# EAGLE design TinyG3DPrinterController (EAGLE 6.6.0)

## Sheet 1 of 2
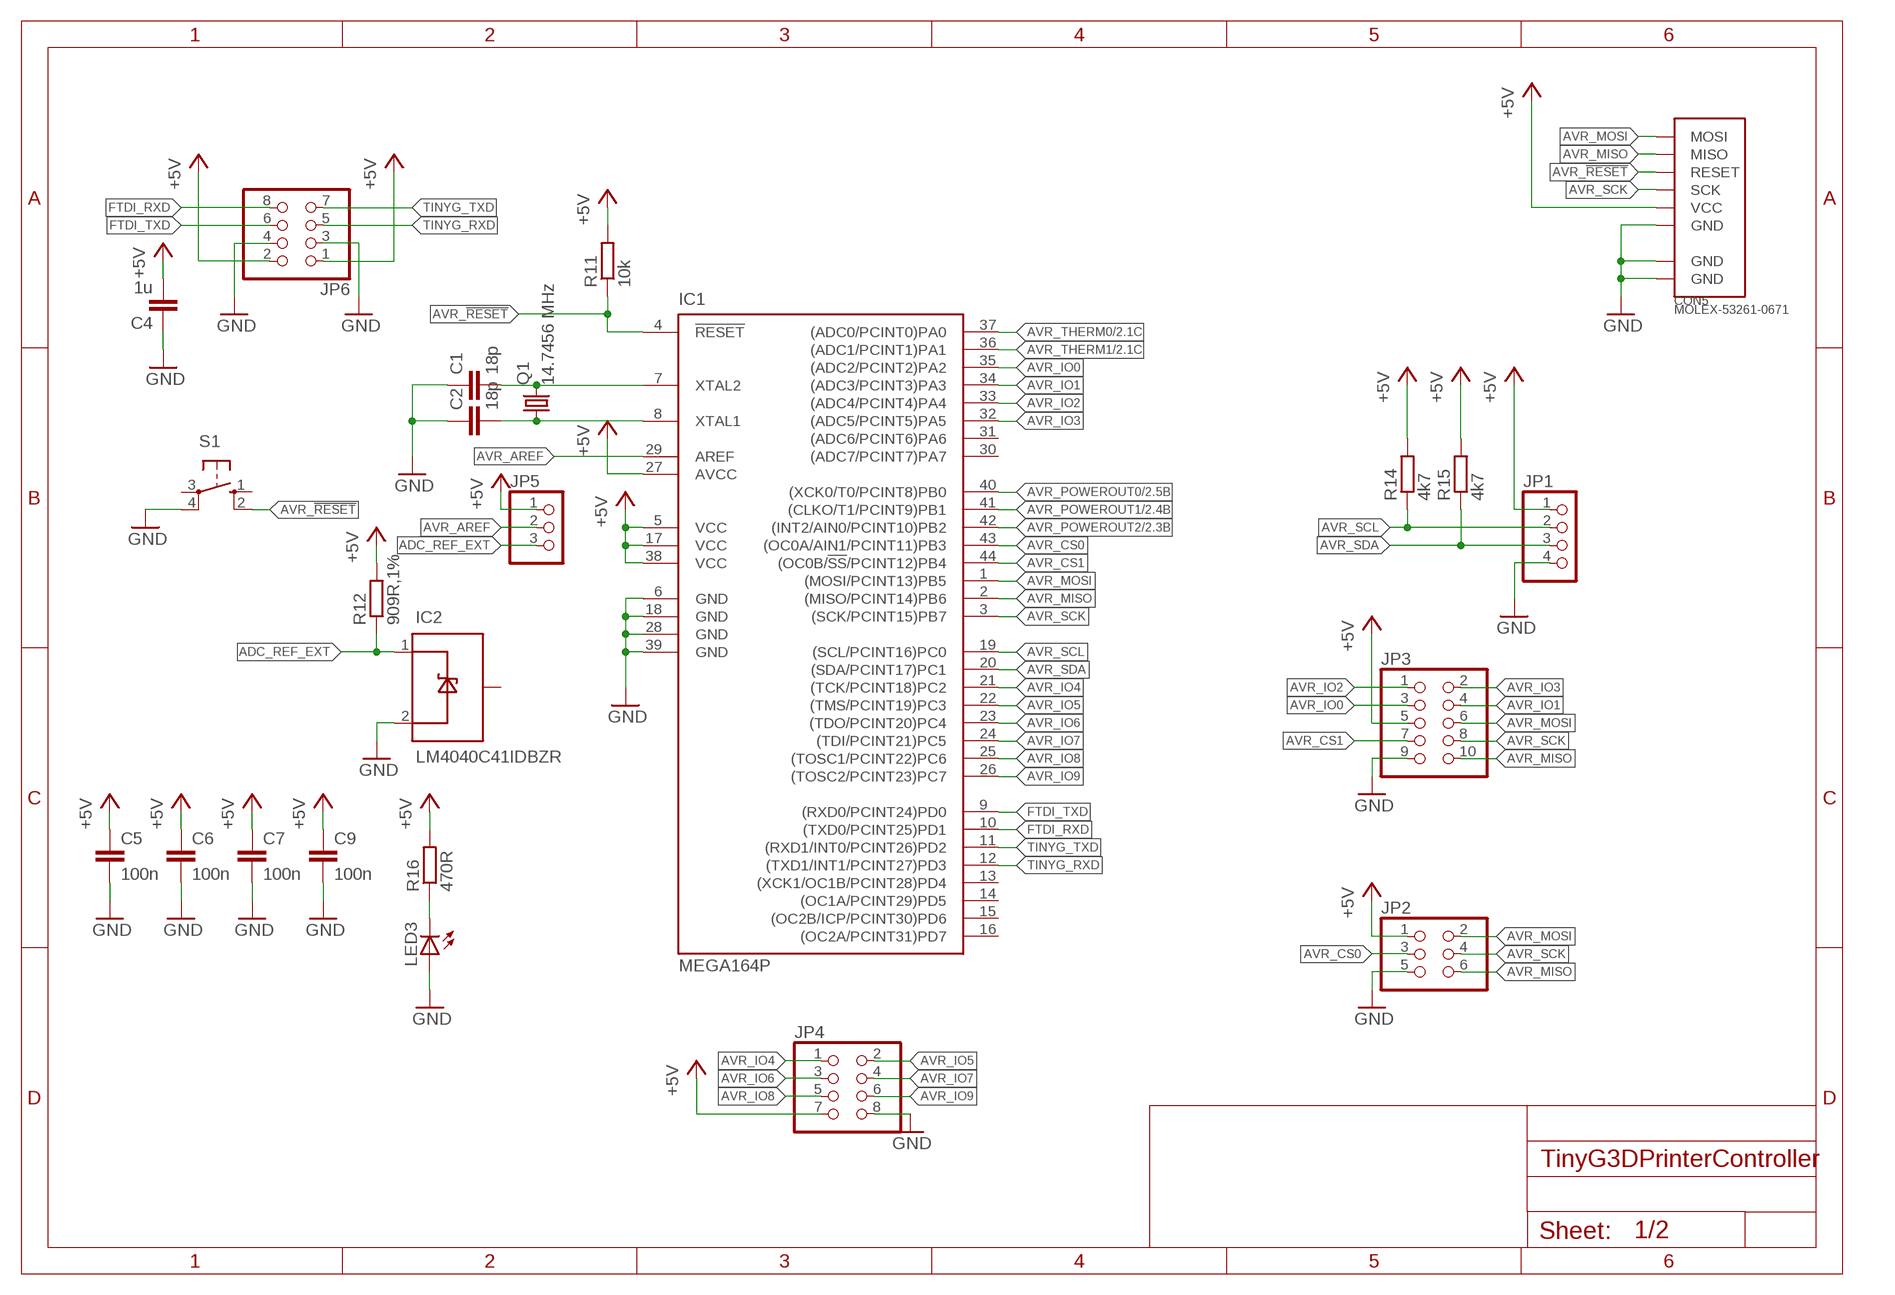
[diagram p0: schematic, sheet 1]

### Parts
C1  18p  C-EUC0603K  [C0603K]
C2  18p  C-EUC0603K  [C0603K]
C4  1u  C-EUC1206K  [C1206K]
C5  100n  C-EUC0603K  [C0603K]
C6  100n  C-EUC0603K  [C0603K]
C7  100n  C-EUC0603K  [C0603K]
C9  100n  C-EUC0603K  [C0603K]
CON5  MOLEX-53261-0671  [MOLEX-53261-0671]
IC1  MEGA164P  MEGA164P/324P/644P-AU  [TQFP44]
IC2  LM4040C41IDBZR  [SOT-23-3]
JP1  PINHD-1X4  [1X04]
JP2  PINHD-2X3  [2X03]
JP3  PINHD-2X5  [2X05]
JP4  PINHD-2X4  [2X04]
JP5  PINHD-1X3  [1X03]
JP6  PINHD-2X4  [2X04]
LED3  LEDCHIP-LED0805  [CHIP-LED0805]
Q1  14.7456 MHz  7A-14.7456MAAJ-T-SMD_CRYSTAL  [CRYSTAL_2P_5MMX3.2MM]
R11  10k  R-EU_R0603  [R0603]
R12  909R,1%  R-EU_R0603  [R0603]
R14  4k7  R-EU_R0603  [R0603]
R15  4k7  R-EU_R0603  [R0603]
R16  470R  R-EU_R0603  [R0603]
S1  10-XX  [B3F-10XX]

### Nets
+5V: C4.2 C5.1 C6.1 C7.1 C9.1 CON5.5(VCC) IC1.5(VCC) IC1.17(VCC) IC1.27(AVCC) IC1.38(VCC) JP1.1 JP2.1 JP3.5 JP4.7 JP5.1 JP6.1 JP6.2 R11.2 R12.2 R14.2 R15.2 R16.2 ; also sheet 2
ADC_REF_EXT: IC2.1 JP5.3 R12.1
AVR_!RESET: CON5.3(RESET) IC1.4(!RESET) R11.1 S1.2(S1)
AVR_AREF: IC1.29(AREF) JP5.2
AVR_CS0: IC1.43((OC0A/AIN1/PCINT11)PB3) JP2.3
AVR_CS1: IC1.44((OC0B/!SS!/PCINT12)PB4) JP3.7
AVR_IO0: IC1.35((ADC2/PCINT2)PA2) JP3.3
AVR_IO1: IC1.34((ADC3/PCINT3)PA3) JP3.4
AVR_IO2: IC1.33((ADC4/PCINT4)PA4) JP3.1
AVR_IO3: IC1.32((ADC5/PCINT5)PA5) JP3.2
AVR_IO4: IC1.21((TCK/PCINT18)PC2) JP4.1
AVR_IO5: IC1.22((TMS/PCINT19)PC3) JP4.2
AVR_IO6: IC1.23((TDO/PCINT20)PC4) JP4.3
AVR_IO7: IC1.24((TDI/PCINT21)PC5) JP4.4
AVR_IO8: IC1.25((TOSC1/PCINT22)PC6) JP4.5
AVR_IO9: IC1.26((TOSC2/PCINT23)PC7) JP4.6
AVR_MISO: CON5.2(MISO) IC1.2((MISO/PCINT14)PB6) JP2.6 JP3.10
AVR_MOSI: CON5.1(MOSI) IC1.1((MOSI/PCINT13)PB5) JP2.2 JP3.6
AVR_POWEROUT0: IC1.40((XCK0/T0/PCINT8)PB0) ; also sheet 2
AVR_POWEROUT1: IC1.41((CLKO/T1/PCINT9)PB1) ; also sheet 2
AVR_POWEROUT2: IC1.42((INT2/AIN0/PCINT10)PB2) ; also sheet 2
AVR_SCK: CON5.4(SCK) IC1.3((SCK/PCINT15)PB7) JP2.4 JP3.8
AVR_SCL: IC1.19((SCL/PCINT16)PC0) JP1.2 R14.1
AVR_SDA: IC1.20((SDA/PCINT17)PC1) JP1.3 R15.1
AVR_THERM0: IC1.37((ADC0/PCINT0)PA0) ; also sheet 2
AVR_THERM1: IC1.36((ADC1/PCINT1)PA1) ; also sheet 2
FTDI_RXD: IC1.10((TXD0/PCINT25)PD1) JP6.8
FTDI_TXD: IC1.9((RXD0/PCINT24)PD0) JP6.6
GND: C1.1 C2.1 C4.1 C5.2 C6.2 C7.2 C9.2 CON5.6(GND) CON5.GND@1(GND) CON5.GND@2(GND) IC1.6(GND) IC1.18(GND) IC1.28(GND) IC1.39(GND) IC2.2 JP1.4 JP2.5 JP3.9 JP4.8 JP6.3 JP6.4 LED3.A S1.4(P1) ; also sheet 2
N$1: C1.2 IC1.7(XTAL2) Q1.P$2
N$2: C2.2 IC1.8(XTAL1) Q1.P$1
N$12: LED3.C R16.1
TINYG_RXD: IC1.12((TXD1/INT1/PCINT27)PD3) JP6.5
TINYG_TXD: IC1.11((RXD1/INT0/PCINT26)PD2) JP6.7
Unconnected: IC1.13((XCK1/OC1B/PCINT28)PD4) IC1.14((OC1A/PCINT29)PD5) IC1.15((OC2B/ICP/PCINT30)PD6) IC1.16((OC2A/PCINT31)PD7) IC1.30((ADC7/PCINT7)PA7) IC1.31((ADC6/PCINT6)PA6) IC2.3 S1.1(S) S1.3(P)

## Sheet 2 of 2
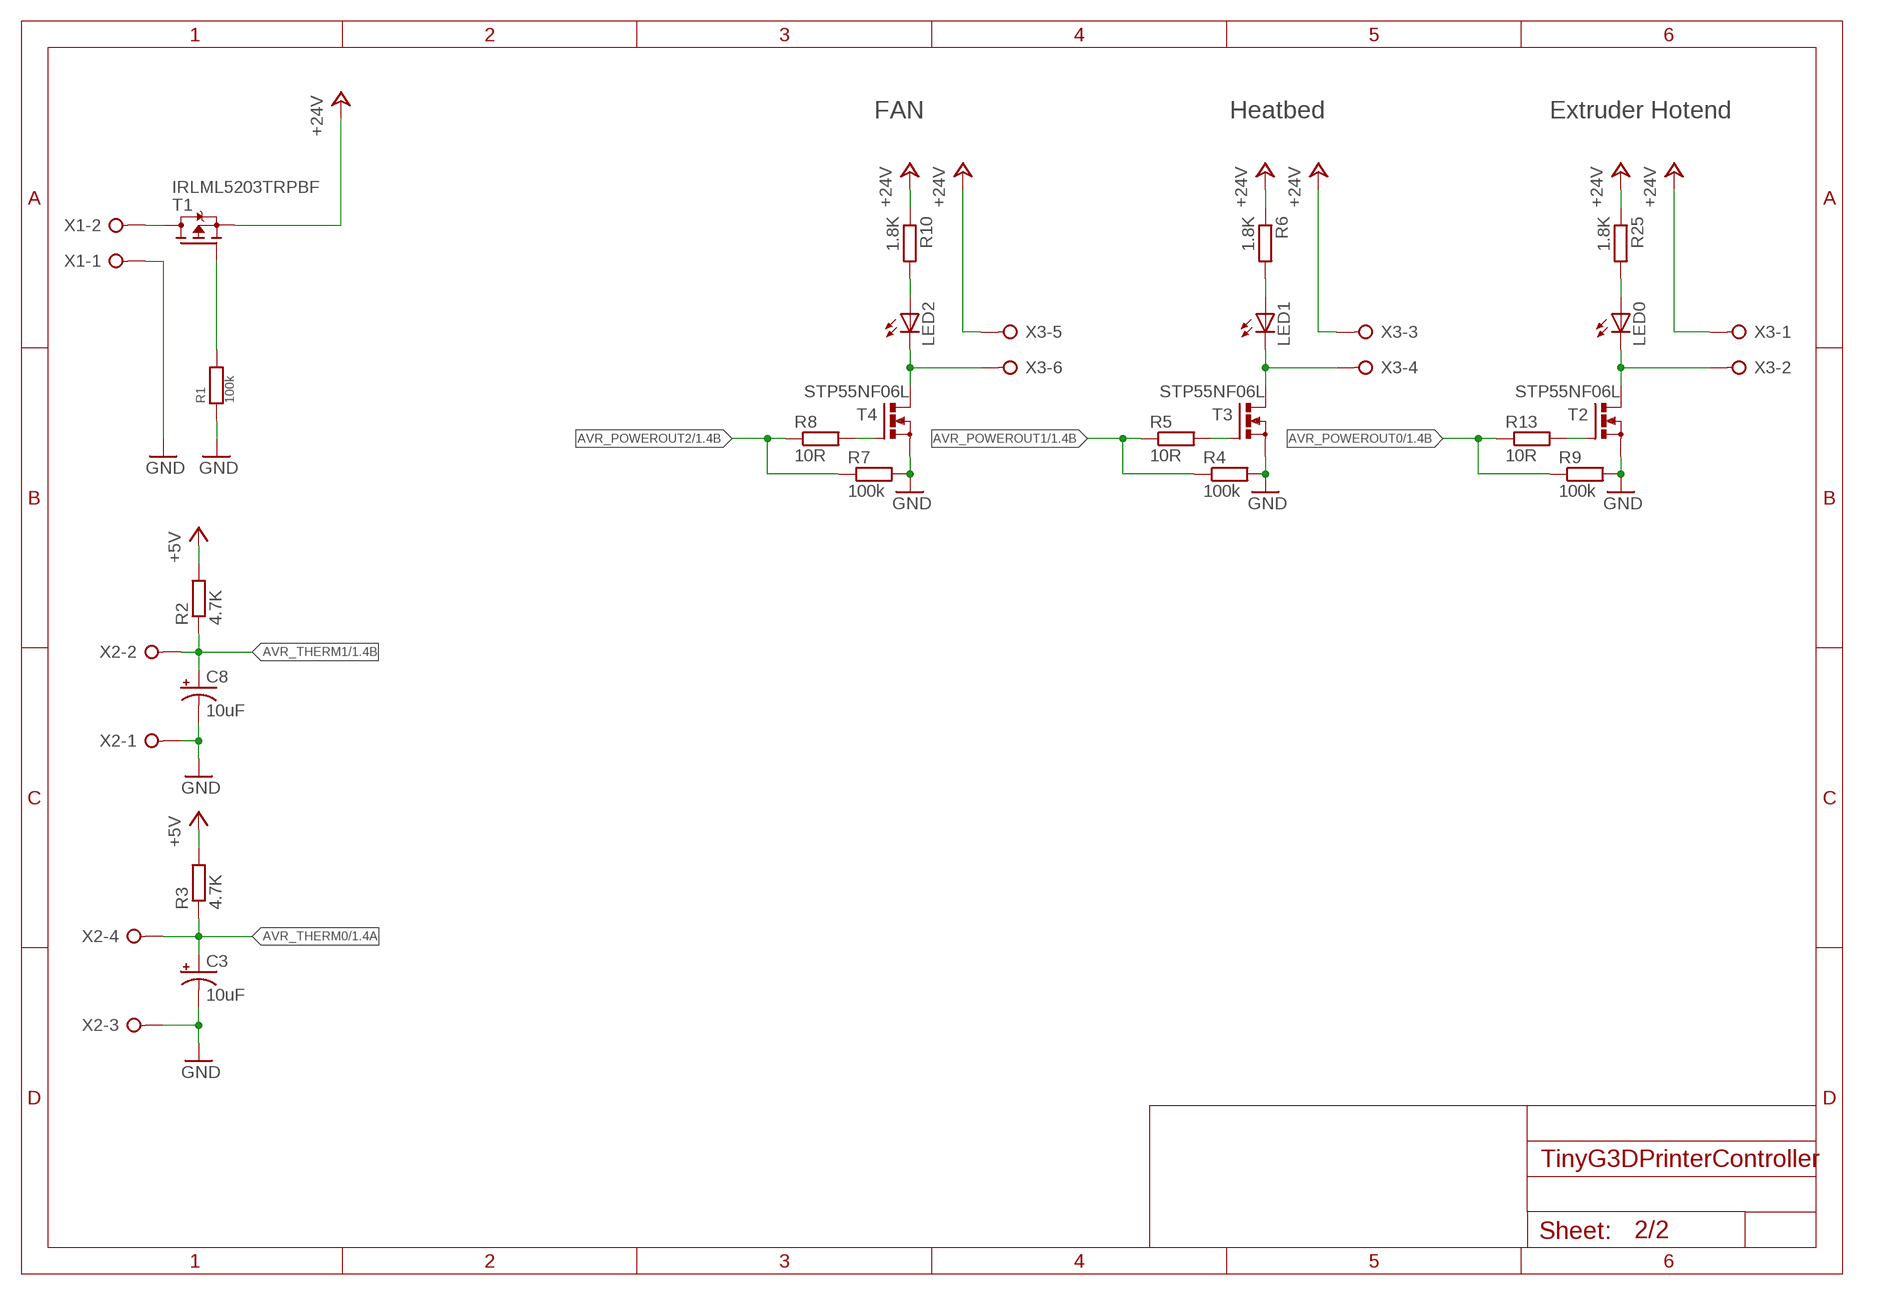
[diagram p1: schematic, sheet 2]

### Parts
C3  10uF  CPOL-US153CLV-0405  [153CLV-0405]
C8  10uF  CPOL-US153CLV-0405  [153CLV-0405]
LED0  LEDCHIP-LED0805  [CHIP-LED0805]
LED1  LEDCHIP-LED0805  [CHIP-LED0805]
LED2  LEDCHIP-LED0805  [CHIP-LED0805]
R1  100k  R0603  [R0603]
R2  4.7K  R-EU_R0603  [R0603]
R3  4.7K  R-EU_R0603  [R0603]
R4  100k  R-EU_R0603  [R0603]
R5  10R  R-EU_R0603  [R0603]
R6  1.8K  R-EU_R0603  [R0603]
R7  100k  R-EU_R0603  [R0603]
R8  10R  R-EU_R0603  [R0603]
R9  100k  R-EU_R0603  [R0603]
R10  1.8K  R-EU_R0603  [R0603]
R13  10R  R-EU_R0603  [R0603]
R25  1.8K  R-EU_R0603  [R0603]
T1  IRLML5203TRPBF  [SOT23]
T2  STP55NF06L  IRF512  [TO220BV]
T3  STP55NF06L  IRF512  [TO220BV]
T4  STP55NF06L  IRF512  [TO220BV]
X1  W237-02P  [W237-132]
X2  W237-04P  [W237-4P]
X3  W237-06P  [W237-6P]

### Nets
+5V: R2.2 R3.2 ; also sheet 1
+24V: R6.1 R10.1 R25.1 T1.2(S) X3.1 X3.3 X3.5
AVR_POWEROUT0: R9.1 R13.1 ; also sheet 1
AVR_POWEROUT1: R4.1 R5.1 ; also sheet 1
AVR_POWEROUT2: R7.1 R8.1 ; also sheet 1
AVR_THERM0: C3.+ R3.1 X2.4 ; also sheet 1
AVR_THERM1: C8.+ R2.1 X2.2 ; also sheet 1
GND: C3.- C8.- R1.1 R4.2 R7.2 R9.2 T2.S T3.S T4.S X1.1 X2.1 X2.3 ; also sheet 1
N$3: R1.2 T1.1(G)
N$4: T1.3(D) X1.2
N$5: LED0.C T2.D X3.2
N$6: R5.2 T3.G
N$7: LED1.A R6.2
N$8: LED1.C T3.D X3.4
N$9: R8.2 T4.G
N$10: LED2.A R10.2
N$11: LED2.C T4.D X3.6
N$48: R13.2 T2.G
N$50: LED0.A R25.2

### Notes on the sheet
- FAN | Heatbed | Extruder Hotend

## Library data of the parts
C1 C2 C4-C7 C9 = rcl:C-EU: CAPACITOR, European symbol
C3 C8 = adafruit:CPOL-US: POLARIZED CAPACITOR, American symbol
CON5 = SchlegelAr_Master:MOLEX-53261-0671: MOLEX-53261-0671 - Molex picoblade 53261-0671 6 pol last modified: Armin Schlegel, 28.04.2014 http://de.mouser.com/ProductDetail/Molex/53261-0671/?qs=%2Fha2pyFadujL8XqTNrjzA%2Fy0AZso5hx2IWE7X8dEAdsn1tpb%2FKahAA%3D%3D http://www.mouser.com/ds/2/276/0532610671_PCB_HEADERS-170915.pdf
IC1 = avr-7:MEGA164P/324P/644P-AU
IC2 = SchlegelArmin:LM4040C41IDBZR: LM4040C41IDBZR Spannungsreferenzen 4.096-V Precision Mcrpwr Shunt .5% acc Mouser Link <http://www.mouser.de/ProductDetail/Texas-Instruments/LM4040C41IDBZR/?qs=sGAEpiMZZMuBck1X%252b7j9fBabmn44eJPpud3DQU8p4AU%3d> Datenblatt <http://www.mouser.com/ds/2/405/lm4040c41-556715.pdf>
JP1 = pinhead:PINHD-1X4: PIN HEADER
JP2 = pinhead:PINHD-2X3: PIN HEADER
JP3 = pinhead:PINHD-2X5: PIN HEADER
JP4 JP6 = pinhead:PINHD-2X4: PIN HEADER
JP5 = pinhead:PINHD-1X3: PIN HEADER
LED0 LED1-LED3 = led:LED: LED OSRAM: - CHIPLED LG R971, LG N971, LY N971, LG Q971, LY Q971, LO R971, LY R971 LH N974, LH R974 LS Q976, LO Q976, LY Q976 LO Q996 - Hyper CHIPLED LW Q18S LB Q993, LB Q99A, LB R99A - SideLED LS A670, LO A670, LY A670, LG A670, LP A670 LB A673, LV A673, LT A673, LW A673 LH A674 LY A675 LS A676, LA A676, LO A676, LY A676, LW A676 LS A679, LY A679, LG A679 - Hyper Micro SIDELED® LS Y876, LA Y876, LO Y876, LY Y876 LT Y87S - SmartLED LW L88C, LW L88S LB L89C, LB L89S, LG L890 LS L89K, LO L89K, LY L89K LS L896, LA L896, LO L896, LY L896 - TOPLED LS T670, LO T670, LY T670, LG T670, LP T670 LSG T670, LSP T670, LSY T670, LOP T670, LYG T670 LG T671, LOG T671, LSG T671 LB T673, LV T673, LT T673, LW T673 LH T674 LS T676, LA T676, LO T676, LY T676, LB T676, LH T676, LSB T676, LW T676 LB T67C, LV T67C, LT T67C, LS T67K, LO T67K, LY T67K, LW E67C LS E67B, LA E67B, LO E67B, LY E67B, LB E67C, LV E67C, LT E67C LW T67C LS T679, LY T679, LG T679 LS T770, LO T770, LY T770, LG T770, LP T770 LB T773, LV T773, LT T773, LW T773 LH T774 LS E675, LA E675, LY E675, LS T675 LS T776, LA T776, LO T776, LY T776, LB T776 LHGB T686 LT T68C, LB T68C - Hyper Mini TOPLED® LB M676 - Mini TOPLED Santana® LG M470 LS M47K, LO M47K, LY M47K Source: http://www.osram.convergy.de LUXEON: - LUMILED® LXK2-PW12-R00, LXK2-PW12-S00, LXK2-PW14-U00, LXK2-PW14-V00 LXK2-PM12-R00, LXK2-PM12-S00, LXK2-PM14-U00 LXK2-PE12-Q00, LXK2-PE12-R00, LXK2-PE12-S00, LXK2-PE14-T00, LXK2-PE14-U00 LXK2-PB12-K00, LXK2-PB12-L00, LXK2-PB12-M00, LXK2-PB14-N00, LXK2-PB14-P00, LXK2-PB14-Q00 LXK2-PR12-L00, LXK2-PR12-M00, LXK2-PR14-Q00, LXK2-PR14-R00 LXK2-PD12-Q00, LXK2-PD12-R00, LXK2-PD12-S00 LXK2-PH12-R00, LXK2-PH12-S00 LXK2-PL12-P00, LXK2-PL12-Q00, LXK2-PL12-R00 Source: www.luxeon.com KINGBRIGHT: KA-3528ASYC Source: www.kingbright.com
Q1 = SchlegelArmin:7A-14.7456MAAJ-T-SMD_CRYSTAL: 7A-14.7456MAAJ-T - SMD Crystal 14.7456 MHz - 5mm x 3.2mm Mouser Link <http://www.mouser.de/ProductDetail/TXC-Corporation/7A-147456MAAJ-T/?qs=sGAEpiMZZMsBj6bBr9Q9adCqSFogF%2fCnC4CKHvO9H9A%3d> Datenblatt <http://www.mouser.com/ds/2/417/7a-13881.pdf>
R1 = SchlegelAr_Master:R: Widerstaende in 0402, 0603, 0805, 1206, 2512 last modified: Armin Schlegel, 28.04.2014
R2-R16 R25 = rcl:R-EU_: RESISTOR, European symbol
S1 = switch-omron:10-XX: OMRON SWITCH; MPN: B3F-1000; OC_FARNELL: 176432; OC_NEWARK: 36M3542
T1 = SchlegelAr_Master:IRLML5203TRPBF: IRLML5203TRPBF - MOSFET MOSFT P-Ch -30V -3A 98mOhm 9.5nC Log Lvl last modified: Armin Schlegel, 28.04.2014 http://de.mouser.com/ProductDetail/International-Rectifier/IRLML5203TRPBF/?qs=sGAEpiMZZMshyDBzk1%2fWi5%252bqVgN3%252bWS8t7qb9msI9Rk%3d http://www.mouser.com/ds/2/200/irlml5203pbf-223113.pdf
T2-T4 = transistor-power:IRF512: N-CHANNEL MOS FET
X1 = con-wago-508:W237-02P: WAGO SREW CLAMP; OC_FARNELL: unknown; OC_NEWARK: unknown
X2 = con-wago-508:W237-04P: WAGO SREW CLAMP; OC_FARNELL: unknown; OC_NEWARK: unknown
X3 = con-wago-508:W237-06P: WAGO SREW CLAMP; OC_FARNELL: unknown; OC_NEWARK: unknown

## Board
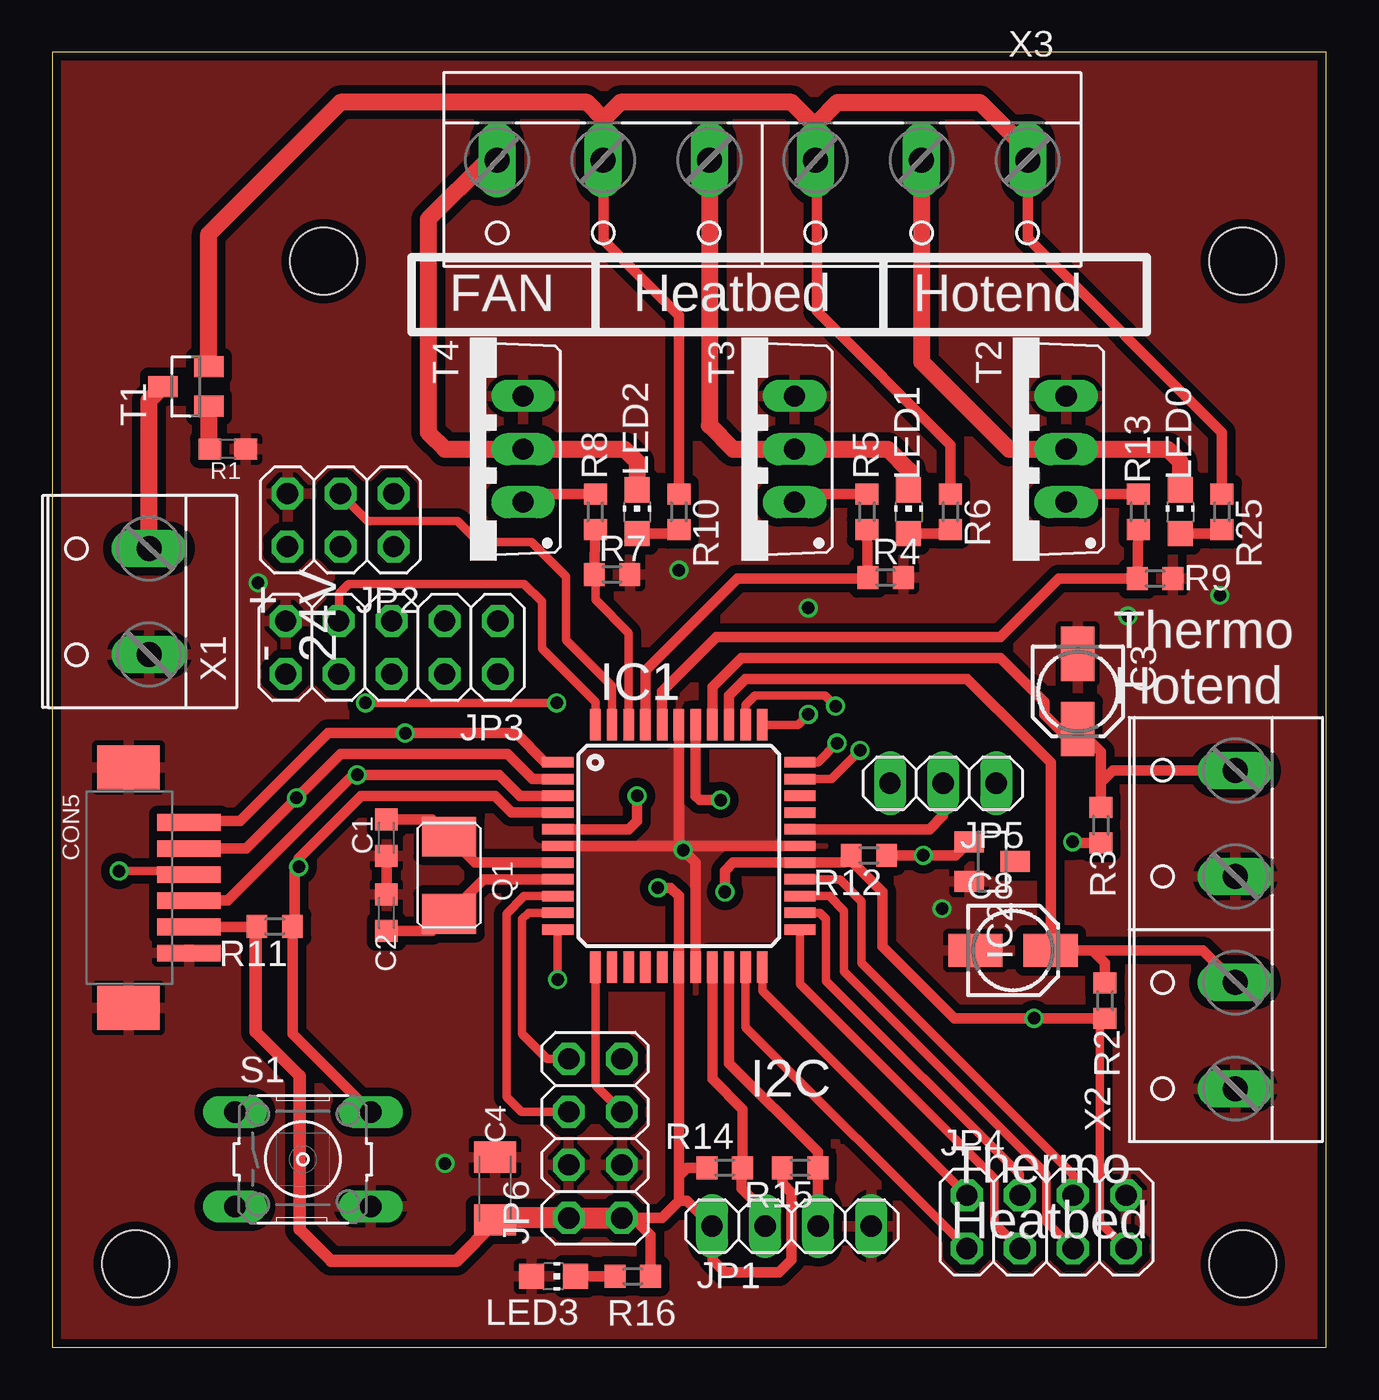
[diagram p2: board, top side]
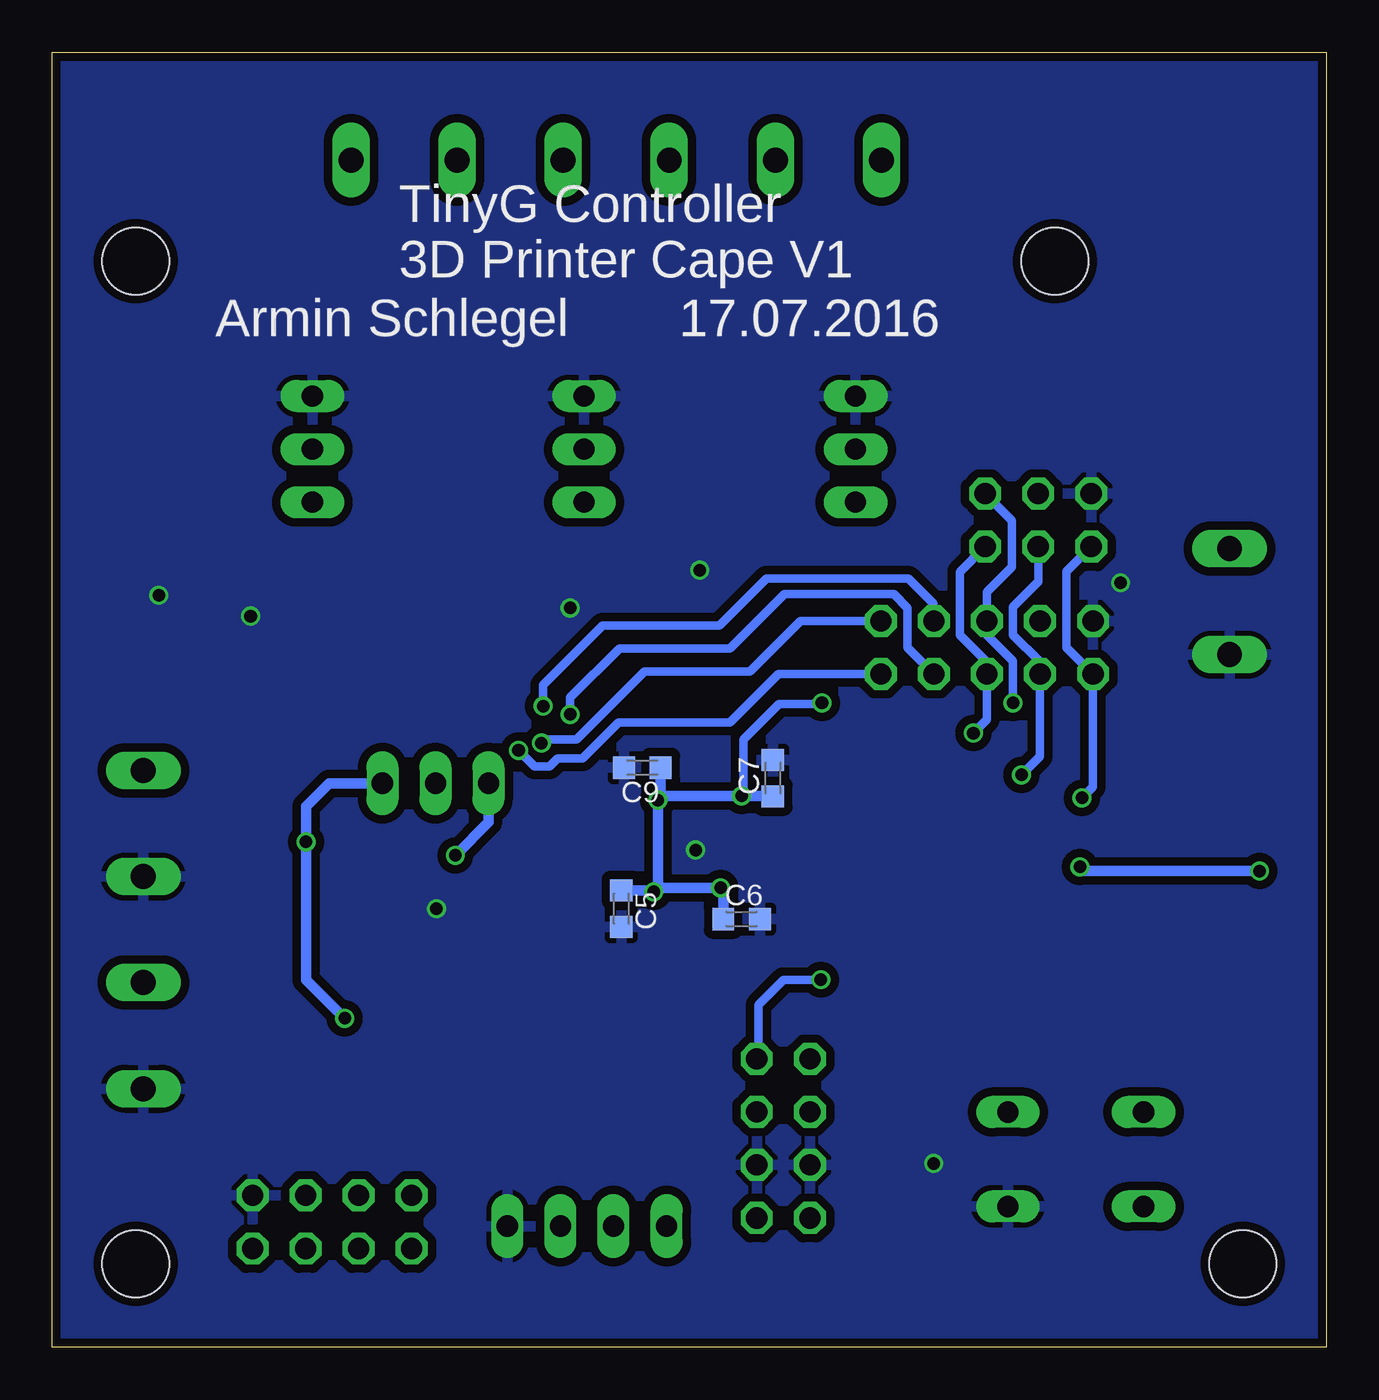
[diagram p3: board, bottom side, seen from below]

Size 61 x 62 mm. Coordinates in mm from the lower left corner, seen from the top.
Outline: 0,0 61,0 61,62 0,62 0,0
Copper layers (1*16): Top 0.035mm / dielectric 1.5mm / Bottom 0.035mm
Design rules "Elecrow_2-layer_eagle_rule": minimum track width 6mil, minimum drill 12mil, track to track 6mil, track to pad 6mil, pad to pad 6mil, via to via 6mil, smd to smd 0mil, copper to edge 10mil, drill to drill 10mil, minimum pad ring 10mil, minimum via ring 6mil, stop-mask expansion 2mil, vias tented up to drill 100mil, thermal gap 10mil
Holes 3.2 mm at 4,4 57,4 13,52 57,52

### Footprints (pad centres in the part's own frame; a part is rotated, then mirrored left to right if it is on the bottom)
C0603K = smd 1.05 x 1.08: 1 -0.875,0; 2 0.875,0
153CLV-0405 = smd 2.6 x 1.6: + 1.8,0; - -1.8,0
C1206K = smd 1.5 x 2: 1 -1.5,0; 2 1.5,0
MOLEX-53261-0671 = smd 0.8 x 3.048: 1 -3.125,2.55; 2 -1.875,2.55; 3 -0.625,2.55; 4 0.625,2.55; 5 1.875,2.55; 6 3.125,2.55 | smd 2.1 x 3: GND@1 -5.75,-0.35; GND@2 5.75,-0.35
TQFP44 = smd 1.5 x 0.5: 1 -5.8,4; 2 -5.8,3.2; 3 -5.8,2.4; 4 -5.8,1.6; 5 -5.8,0.8; 6 -5.8,0; 7 -5.8,-0.8; 8 -5.8,-1.6; 9 -5.8,-2.4; 10 -5.8,-3.2; 11 -5.8,-4; 23 5.8,-4; 24 5.8,-3.2; 25 5.8,-2.4; 26 5.8,-1.6; 27 5.8,-0.8; 28 5.8,0; 29 5.8,0.8; 30 5.8,1.6; 31 5.8,2.4; 32 5.8,3.2; 33 5.8,4 | smd 0.5 x 1.5: 12 -4,-5.8; 13 -3.2,-5.8; 14 -2.4,-5.8; 15 -1.6,-5.8; 16 -0.8,-5.8; 17 0,-5.8; 18 0.8,-5.8; 19 1.6,-5.8; 20 2.4,-5.8; 21 3.2,-5.8; 22 4,-5.8; 34 4,5.8; 35 3.2,5.8; 36 2.4,5.8; 37 1.6,5.8; 38 0.8,5.8; 39 0,5.8; 40 -0.8,5.8; 41 -1.6,5.8; 42 -2.4,5.8; 43 -3.2,5.8; 44 -4,5.8
SOT-23-3 = smd 1 x 1.4: 1 -0.95,-1.1; 2 0.95,-1.1; 3 0,1.1
1X04 = drill 1.016 long: 1 -3.81,0; 2 -1.27,0; 3 1.27,0; 4 3.81,0
2X03 = drill 1.016 octagon: 1 -2.54,-1.27; 2 -2.54,1.27; 3 0,-1.27; 4 0,1.27; 5 2.54,-1.27; 6 2.54,1.27
2X05 = drill 1.016 octagon: 1 -5.08,-1.27; 2 -5.08,1.27; 3 -2.54,-1.27; 4 -2.54,1.27; 5 0,-1.27; 6 0,1.27; 7 2.54,-1.27; 8 2.54,1.27; 9 5.08,-1.27; 10 5.08,1.27
2X04 = drill 1.016 octagon: 1 -3.81,-1.27; 2 -3.81,1.27; 3 -1.27,-1.27; 4 -1.27,1.27; 5 1.27,-1.27; 6 1.27,1.27; 7 3.81,-1.27; 8 3.81,1.27
1X03 = drill 1.016 long: 1 -2.54,0; 2 0,0; 3 2.54,0
CHIP-LED0805 = smd 1.2 x 1.2: A 0,-1.05; C 0,1.05
CRYSTAL_2P_5MMX3.2MM = smd 1.9 x 2.6: P$1 1.85,0; P$2 -1.85,0
R0603 = smd 1.1 x 1: 1 -0.85,0; 2 0.85,0
R0603' = smd 1 x 1.1: 1 -0.85,0; 2 0.85,0
B3F-10XX = drill 1.016 long: 1 -3.251,2.261; 2 3.251,2.261; 3 -3.251,-2.261; 4 3.251,-2.261
SOT23 = smd 1 x 1.4: 1 -0.95,-1.1; 2 0.95,-1.1; 3 0,1.1
TO220BV = drill 1.016 long: D 0,-2.54; G -2.54,-2.54; S 2.54,-2.54
W237-132 = drill 1.194 long: 1 -2.54,-0.635; 2 2.54,-0.635
W237-4P = drill 1.194 long: 1 -7.62,-0.635; 2 -2.54,-0.635; 3 2.54,-0.635; 4 7.62,-0.635
W237-6P = drill 1.194 long: 1 -12.7,-0.635; 2 -7.62,-0.635; 3 -2.54,-0.635; 4 2.54,-0.635; 5 7.62,-0.635; 6 12.7,-0.635

### Placement (x,y rotation side)
C1  16,24.4 90 top
C2  16,20.8 270 top
C3  49.1,31.4 270 top
C4  21.2,7.6 270 top
C5  33.75,21 270 bottom
C6  28,20.5 0 bottom
C7  26.5,27.25 90 bottom
C8  46,19 0 top
C9  32.75,27.75 180 bottom
CON5  4,22 270 top
IC1  30,24 0 top
IC2  45,23.25 270 top
JP1  35.4,5.8 0 top
JP2  13.8,39.6 180 top
JP3  16.25,33.5 180 top
JP4  47.6,6 0 top
JP5  42.65,27 180 top
JP6  26,10 90 top
LED0  54,40 0 top
LED1  41,40 0 top
LED2  28,40 0 top
LED3  24,3.4 270 top
Q1  19,22.6 270 top
R1  8.4,43 180 top
R2  4.7K  [R0603']  50.4,16.6 270 top
R3  4.7K  [R0603']  50.2,25 270 top
R4  100k  [R0603']  39.9,36.85 0 top
R5  10R  [R0603']  39,40 90 top
R6  1.8K  [R0603']  43,40 270 top
R7  100k  [R0603']  26.8,37 0 top
R8  10R  [R0603']  26,40 90 top
R9  100k  [R0603']  52.8,36.8 0 top
R10  1.8K  [R0603']  30,40 270 top
R11  10k  [R0603']  10.65,20.15 180 top
R12  909R,1%  [R0603']  39.1,23.55 180 top
R13  10R  [R0603']  52,40 90 top
R14  4k7  [R0603']  32.2,8.6 180 top
R15  4k7  [R0603']  35.8,8.6 180 top
R16  470R  [R0603']  27.8,3.4 0 top
R25  1.8K  [R0603']  56,40 270 top
S1  12,9 0 top
T1  6.4,46 90 top
T2  46,43 90 top
T3  33,43 90 top
T4  20,43 90 top
X1  4,35.7 90 top
X2  56,20 90 top
X3  34,56.2 180 top

### Tracks (layer width: path | path; a pad name or v marks a point on that pad's centre or on a via)
+5V  (via drill 0.6)
  Top 0.406: v15,30.85 v24.15,30.85 | JP4.7 50.15,5.99 50.15,15.4 49.8,15.75
  Top 0.5: IC1.5 27.6,24.8 28,25.2 v28,26.4 | IC1.38 30.8,26.4 31,26.2 v32,26.2 | v32.2,21.8 32.2,22.8 32.6,23.2 IC1.27 37.9,23.2 R12.2 38.25,23.3 39.75,21.8 39.75,19.2 43.2,15.75 v47,15.75 49.8,15.75 R2.2 | v29,22 29.6,22 30,21.6 IC1.17 30,8.2 | 30,8.2 30,7 | 30,7 29.2,6.2 27.8,6.2 | 27.8,6.2 JP6.1 | 30,8.2 30.4,8.6 R14.2 | 30,7 30.39,7 JP1.1 31.6,4.2 32.2,3.6 34.8,3.6 35.4,4.2 35.4,7.4 34.95,7.85 R15.2 | R16.2 28.65,5.35 27.8,6.2 | CON5.5 9.78,20.12 R11.2 | R3.2 48.9,24.15 v48.85,24.2
  Top 0.6: C4.2 21.2,6 19.35,4.15 13.35,4.15 11.85,5.65 11.85,13 9.75,15.1 9.75,20.1 R11.2
  Top 1.016: C4.2 21.29,6.19 JP6.2 JP6.1
  Bottom 0.406: 28.98,20.4 C6.1 | 33.8,21.93 C5.1 | 31.82,27.8 C9.1 | 26.6,26.27 C7.1 | 27.9,26.3 v28,26.4 27.9,26.5 27.9,29.1 26.2,30.8 24.2,30.8 v24.15,30.85 | JP2.1 15.05,39.58 15.05,37.35 16.25,36.15 JP3.5 16.25,34.14 16.27,34.12 15,32.85 v15,30.85
  Bottom 0.5: C7.1 26.52,26.4 v28,26.4 31.8,26.4 v32,26.2 | C9.1 31.88,26.32 v32,26.2 | C6.1 28.88,21.88 v29,22 32,22 | C5.1 32.27,21.88 v32.2,21.8 32,22 | v32,26.2 32,22 | v47,15.75 48.85,17.6 v48.85,24.2 48.85,25.9 47.75,27 JP5.1
+24V
  Top 0.5: X3.5 26.61,56.6 26.8,56.6 26.4,56.2 26.4,53 30,49.4 R10.1 | R6.1 43,43.2 36.6,49.6 36.6,56.77 X3.3 | R25.1 56,43.8 46.7,53.1 X3.1
  Top 0.813: T1.2 7.5,53.3 13.8,59.6 25.6,59.6 26.4,58.8 | 26.4,58.8 26.4,56.85 X3.5 26.38,58.38 | X3.1 46.7,57.3 44.4,59.6 37.6,59.6 36.6,58.6 36.6,56.9 X3.3 36.54,58.46 35.4,59.6 27.2,59.6 26.4,58.8
ADC_REF_EXT  (via drill 0.6)
  Top 0.5: R12.1 v41.7,23.55 42.2,23.55 43.25,23.55 IC2.1
  Bottom 0.5: JP5.3 40.11,25.14 v41.7,23.55
AVR_!RESET  (via drill 0.6)
  Top 0.406: v3.2,22.8 6.38,22.8 CON5.3
  Top 0.5: IC1.4 22,25.6 21.2,26.4 14.8,26.4 11.8,23.4 v11.8,23 11.6,22.8 11.6,20.25 R11.1 11.5,15.01 S1.2 | 6.58,22.6 CON5.3
  Bottom 0.5: v3.2,22.8 11.6,22.8 v11.8,23
AVR_AREF
  Top 0.5: IC1.29 42,24.8 42.65,25.45 JP5.2
AVR_CS0
  Top 0.406: IC1.43 26.8,31.65 24.6,33.85 24.6,36.9 22.95,38.55 20.4,38.55 19.4,39.55 15.1,39.55 13.8,40.85 JP2.3
AVR_CS1
  Top 0.406: IC1.44 26,30.9 23.45,33.45 23.45,35.7 22.6,36.55 14.2,36.55 13.73,36.08 13.73,34.79 JP3.7
AVR_IO0  (via drill 0.6)
  Top 0.406: IC1.35 33.2,30.75 33.65,31.2 37,31.2 v37.5,30.7
  Bottom 0.406: JP3.3 18.81,34.77 18.81,35.61 20,36.8 26.8,36.8 29.05,34.55 34.65,34.55 37.5,31.7 v37.5,30.7
AVR_IO1  (via drill 0.6)
  Top 0.406: IC1.34 35.7,29.8 v36.2,30.3
  Bottom 0.406: JP3.4 20.05,33.5 20.05,35.4 20.7,36.05 25.95,36.05 28.55,33.45 33.85,33.45 36.2,31.1 v36.2,30.3
AVR_IO2  (via drill 0.6)
  Top 0.406: IC1.33 36.65,28 v37.58,28.93
  Bottom 0.406: JP3.1 25.18,34.77 27.6,32.35 32.65,32.35 35.9,29.1 37.4,29.1 v37.58,28.93
AVR_IO3  (via drill 0.6)
  Top 0.406: IC1.32 37.3,27.2 v38.67,28.57
  Bottom 0.406: JP3.2 26.22,32.23 28.55,29.9 33.9,29.9 35.6,28.2 36.8,28.2 37.2,27.8 37.9,27.8 v38.67,28.57
AVR_IO4
  Top 0.406: JP4.1 33.2,15.32 IC1.21
AVR_IO5
  Top 0.406: JP4.2 34,17.06 IC1.22
AVR_IO6
  Top 0.406: JP4.3 45.1,5.96 45.1,8.1 35.8,17.4 IC1.23
AVR_IO7
  Top 0.406: IC1.24 36.75,20.8 37.05,20.5 37.05,17.55 46.33,8.27 JP4.4
AVR_IO8
  Top 0.406: IC1.25 37.2,21.6 37.9,20.9 37.9,18 47.6,8.3 47.6,6 JP4.5
AVR_IO9
  Top 0.406: IC1.26 37.7,22.4 38.75,21.35 38.75,18.4 48.87,8.28 JP4.6
AVR_MISO  (via drill 0.6)
  Top 0.5: IC1.2 23,27.2 21.8,28.4 13.8,28.4 v11.7,26.3 9.28,23.88 CON5.2
  Bottom 0.406: JP2.6 12.45,37.14 12.45,33.49 11.19,32.23 JP3.10 11.17,26.83 v11.7,26.3
AVR_MOSI  (via drill 0.6)
  Top 0.5: 6.6,25.18 CON5.1 6.62,25.2 9,25.2 13.2,29.4 v16.9,29.4 22.2,29.4 23.6,28 IC1.1
  Bottom 0.406: JP2.2 17.55,37.12 17.55,34.1 16.3,32.85 16.3,32.26 16.28,32.26 JP3.6 16.25,30.05 v16.9,29.4
AVR_POWEROUT0
  Top 0.5: IC1.40 29.2,31.4 31.8,34 45.4,34 48.2,36.8 R9.1 R13.1
AVR_POWEROUT1
  Top 0.5: IC1.41 28.4,32.4 32.8,36.8 38.95,36.8 R4.1 R5.1
AVR_POWEROUT2
  Top 0.406: IC1.42 27.6,34.2 26,35.8 26,36.95 R7.1
  Top 0.5: R7.1 R8.1
AVR_SCK  (via drill 0.6)
  Top 0.5: IC1.3 22.4,26.4 21.4,27.4 v14.6,27.4 14.4,27.4 8.4,21.4 6.58,21.4 CON5.4
  Bottom 0.406: JP2.4 13.8,36.65 15,35.45 15,34.1 13.75,32.85 13.75,32.25 13.73,32.25 JP3.8 13.71,28.29 v14.6,27.4
AVR_SCL
  Top 0.5: JP1.2 34.13,6.47 33,7.6 33,8.55 R14.1 33.05,11.4 31.6,12.85 IC1.19
AVR_SDA
  Top 0.5: JP1.3 36.67,8.58 R15.1 36.65,9.35 32.4,13.6 IC1.20
AVR_THERM0
  Top 0.5: IC1.37 31.6,31.6 33,33 45.4,33 47.5,30.9 47.5,30.3 48.25,29.55 49.05,29.55 C3.+ 50.2,28.5 50.2,27.05 | R3.1 50.2,27.05 | X2.4 50.77,27.62 50.2,27.05
AVR_THERM1
  Top 0.5: 49.8,19 C8.+ 47.8,28 47.5,28.3 46.73,29.07 43.8,32 33.2,32 32.4,31.2 IC1.36 | 49.8,19 55.09,19 X2.2 | R2.1 50.4,18.4 49.8,19
FTDI_RXD
  Top 0.406: IC1.10 22.8,20.8 22.5,20.5 22.5,15 23.69,13.81 JP6.8
FTDI_TXD
  Top 0.406: JP6.6 22.48,11.27 21.75,12 21.75,20.75 22.6,21.6 IC1.9
GND  (via drill 0.6)
  Top 0.5: IC1.6 30,24 | IC1.28 30.4,24 v30.2,23.8 | IC1.18 30.8,23.2 v30.2,23.8 | IC1.39 30,24 | 30,24 v30.2,23.8 | C1.1 C2.1
  other vias: 30,37.2 36.2,35.4 55.9,36 51.5,35 18.8,8.8 42.6,21 9.85,36.6
  pour Top (isolate 0.406): 0,61.8 61,61.8 61,0 0,0
  pour Bottom (isolate 0.406): 0.2,62 61,62 61,0 0.2,0
N$1
  Top 0.5: IC1.7 20.25,23.2 Q1.P$2 18.18,25.27 C1.2
N$2
  Top 0.5: IC1.8 20.65,22.4 Q1.P$1 18.18,19.93 C2.2
N$3
  Top 0.813: T1.1 7.5,43.05 R1.2
N$4
  Top 0.813: X1.2 4.63,45.34 T1.3
N$5
  Top 0.813: X3.2 41.62,47.18 45.8,43 T2.D 53.4,43 54,42.4 LED0.C
N$6
  Top 0.5: R5.2 35.93,40.85 T3.G
N$7
  Top 0.5: LED1.A 42.8,38.95 R6.2
N$8
  Top 0.813: X3.4 31.46,44.14 32.6,43 T3.D 40,43 41,42 LED1.C
N$9
  Top 0.5: R8.2 22.93,40.85 T4.G
N$10
  Top 0.5: LED2.A 29.8,38.95 R10.2
N$11
  Top 0.813: X3.6 20.84,56.84 18,54 18,43.8 18.8,43 T4.D 27.4,43 28,42.4 LED2.C
N$12
  Top 0.5: R16.1 LED3.C
N$48
  Top 0.5: R13.2 48.93,40.85 T2.G
N$50
  Top 0.5: LED0.A 55.8,38.95 R25.2
TINYG_RXD
  Top 0.406: IC1.12 26,12.54 JP6.5
TINYG_TXD  (via drill 0.6)
  Top 0.406: IC1.11 v24.2,17.6
  Bottom 0.406: v24.2,17.6 26,17.6 27.2,16.4 27.2,13.88 JP6.7

### Text on the board
tNames: FAN | Heatbed | Hotend | - + / 24V | Thermo / Hotend | I2C | Thermo / Heatbed
bNames: TinyG Controller / 3D Printer Cape V1 | 17.07.2016 | Armin Schlegel